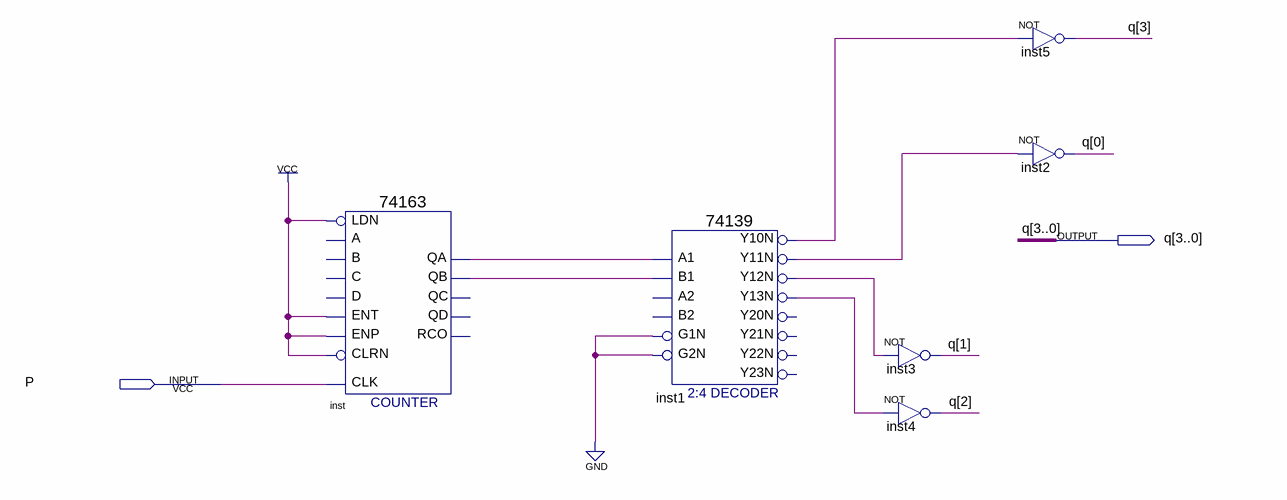
[diagram p0: schematic sheet]
// Quartus schematic jiepai.bdf as structural Verilog: 6 symbols, 2 pins
module jiepai (
  input  P,
  output [3:0] q
);

  wire inst1_y10n, inst1_y11n, inst1_y12n, inst1_y13n, inst_qa, inst_qb;

  \74163  inst (
    .ENT(1'b1), .CLRN(1'b1), .CLK(P), .ENP(1'b1), .LDN(1'b1), .QA(inst_qa), .QB(inst_qb));  // open: C, B, A, D, QC, QD, RCO
  \74139  inst1 (
    .A1(inst_qa), .B1(inst_qb), .G1N(1'b0), .G2N(1'b0), .Y10N(inst1_y10n), .Y13N(inst1_y13n),
    .Y12N(inst1_y12n), .Y11N(inst1_y11n));  // open: A2, B2, Y20N, Y21N, Y22N, Y23N
  not inst3 (q[1], inst1_y12n);
  not inst4 (q[2], inst1_y13n);
  not inst5 (q[3], inst1_y10n);
  not inst2 (q[0], inst1_y11n);
endmodule
